# EAGLE design LK-1 Adapter (EAGLE 9.5.2)

## Sheet 1 of 2
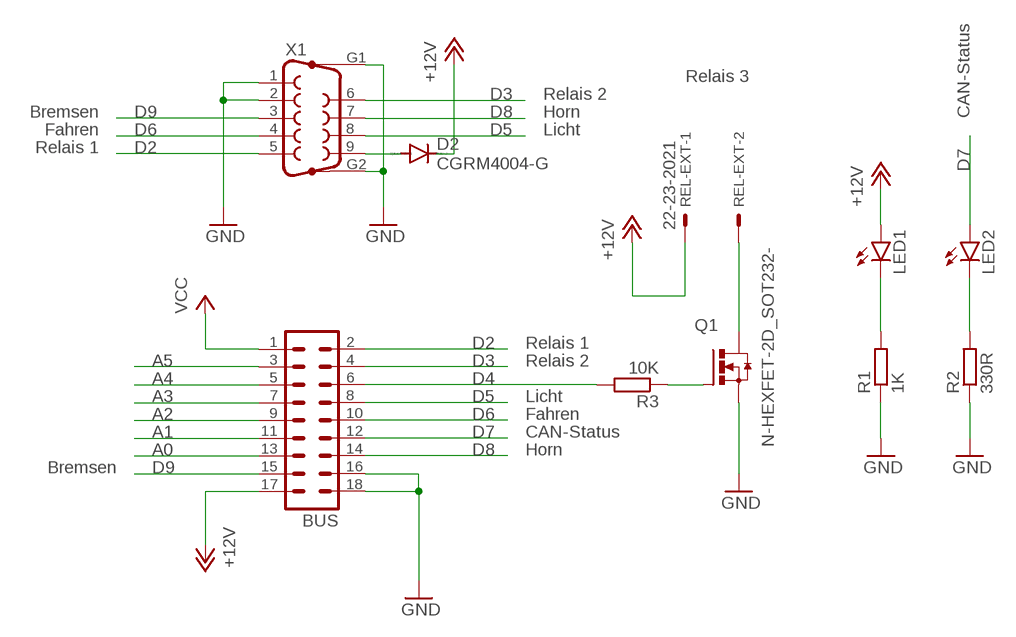
[diagram p0: schematic, sheet 1]

### Parts
BUS  MA09-2  [MA09-2]
D2  CGRM4004-G  [SOD-123_MINI-SMA]
LED1  LED3MM  [LED3MM]
LED2  LED3MM  [LED3MM]
Q1  N-HEXFET-2D_SOT232-  [SOT223]
R1  1K  R-EU_0204/2V  [0204V]
R2  330R  R-EU_0204/2V  [0204V]
R3  10K  R-EU_0204/2V  [0204V]
REL-EXT  22-23-2021  [22-23-2021]
X1  F09VP  [F09VP]

### Nets
+12V: BUS.17 D2.C LED1.A REL-EXT.1
A0: BUS.13
A1: BUS.11
A2: BUS.9
A3: BUS.7
A4: BUS.5
A5: BUS.3
D2: BUS.2 X1.5
D3: BUS.4 X1.6
D4: BUS.6 R3.2
D5: BUS.8 X1.8
D6: BUS.10 X1.4
D7: BUS.12 LED2.A
D8: BUS.14 X1.7
D9: BUS.15 X1.3
GND: BUS.16 BUS.18 Q1.3(S) R1.1 R2.1 X1.1 X1.2 X1.G1 X1.G2
N$1: Q1.1(G) R3.1
N$2: Q1.2(D) Q1.4(D) REL-EXT.2
N$3: D2.A X1.9
N$5: LED1.K(C) R1.2
N$6: LED2.K(C) R2.2
VCC: BUS.1

### Notes on the sheet
- Relais 3
- Relais 2
- Bremsen | Horn | CAN-Status
- Fahren | Licht
- Relais 1
- Relais 1
- Relais 2
- Licht
- Fahren
- CAN-Status
- Horn
- Bremsen

## Sheet 2 of 2

## Library data of the parts
BUS = con-lstb:MA09-2: PIN HEADER; OC_FARNELL: unknown; OC_NEWARK: unknown
D2 = diode:CGRM400*-G: Molded plasitc,JEDEC SOD-123/Mini SMA Source: Comchip CGRM4001-G.pdf
LED1 LED2 = led:LED: LED OSRAM: - CHIPLED LG R971, LG N971, LY N971, LG Q971, LY Q971, LO R971, LY R971 LH N974, LH R974 LS Q976, LO Q976, LY Q976 LO Q996 - Hyper CHIPLED LW Q18S LB Q993, LB Q99A, LB R99A - SideLED LS A670, LO A670, LY A670, LG A670, LP A670 LB A673, LV A673, LT A673, LW A673 LH A674 LY A675 LS A676, LA A676, LO A676, LY A676, LW A676 LS A679, LY A679, LG A679 - Hyper Micro SIDELED® LS Y876, LA Y876, LO Y876, LY Y876 LT Y87S - SmartLED LW L88C, LW L88S LB L89C, LB L89S, LG L890 LS L89K, LO L89K, LY L89K LS L896, LA L896, LO L896, LY L896 - TOPLED LS T670, LO T670, LY T670, LG T670, LP T670 LSG T670, LSP T670, LSY T670, LOP T670, LYG T670 LG T671, LOG T671, LSG T671 LB T673, LV T673, LT T673, LW T673 LH T674 LS T676, LA T676, LO T676, LY T676, LB T676, LH T676, LSB T676, LW T676 LB T67C, LV T67C, LT T67C, LS T67K, LO T67K, LY T67K, LW E67C LS E67B, LA E67B, LO E67B, LY E67B, LB E67C, LV E67C, LT E67C LW T67C LS T679, LY T679, LG T679 LS T770, LO T770, LY T770, LG T770, LP T770 LB T773, LV T773, LT T773, LW T773 LH T774 LS E675, LA E675, LY E675, LS T675 LS T776, LA T776, LO T776, LY T776, LB T776 LHGB T686 LT T68C, LB T68C - Hyper Mini TOPLED® LB M676 - Mini TOPLED Santana® LG M470 LS M47K, LO M47K, LY M47K Source: http://www.osram.convergy.de LUXEON: - LUMILED® LXK2-PW12-R00, LXK2-PW12-S00, LXK2-PW14-U00, LXK2-PW14-V00 LXK2-PM12-R00, LXK2-PM12-S00, LXK2-PM14-U00 LXK2-PE12-Q00, LXK2-PE12-R00, LXK2-PE12-S00, LXK2-PE14-T00, LXK2-PE14-U00 LXK2-PB12-K00, LXK2-PB12-L00, LXK2-PB12-M00, LXK2-PB14-N00, LXK2-PB14-P00, LXK2-PB14-Q00 LXK2-PR12-L00, LXK2-PR12-M00, LXK2-PR14-Q00, LXK2-PR14-R00 LXK2-PD12-Q00, LXK2-PD12-R00, LXK2-PD12-S00 LXK2-PH12-R00, LXK2-PH12-S00 LXK2-PL12-P00, LXK2-PL12-Q00, LXK2-PL12-R00 Source: www.luxeon.com KINGBRIGHT: KA-3528ASYC Source: www.kingbright.com
Q1 = transistor-power:N-HEXFET-2D_?-*: HEXFET® Power MOSFET 2 Drain connects http://www.irf.com/product-info/datasheets/data/irll014n.pdf
R1-R3 = rcl:R-EU_: RESISTOR, European symbol; SPICEPREFIX: R
REL-EXT = con-molex:22-23-2021: .100" (2.54mm) Center Header - 2 Pin; MF: MOLEX; MPN: 22-23-2021; OC_FARNELL: 1462926; OC_NEWARK: 25C3832
X1 = con-subd:F09VP: SUB-D; OC_FARNELL: unknown; OC_NEWARK: unknown

## Board
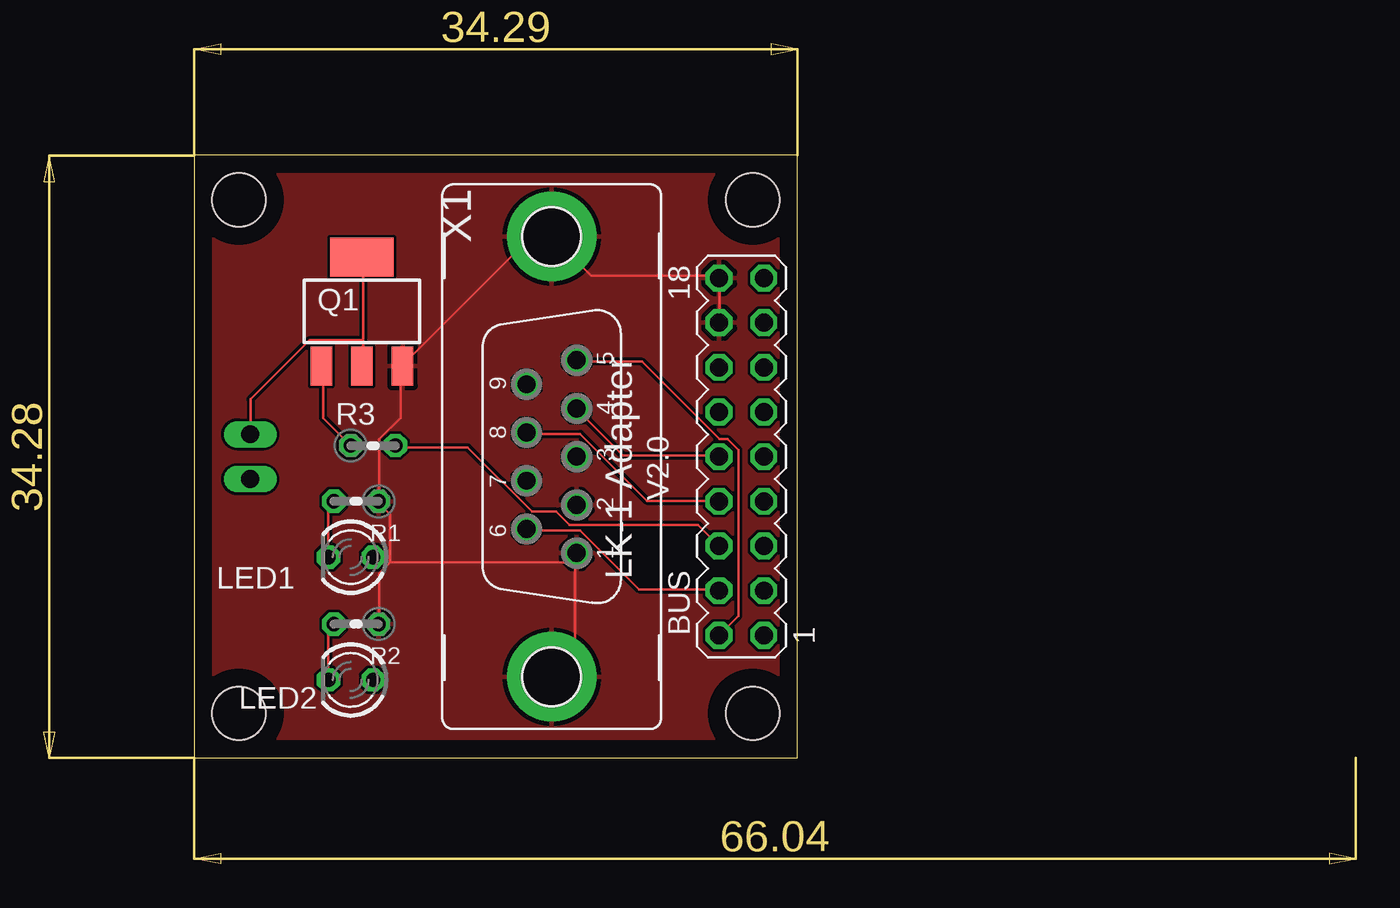
[diagram p1: board, top side]
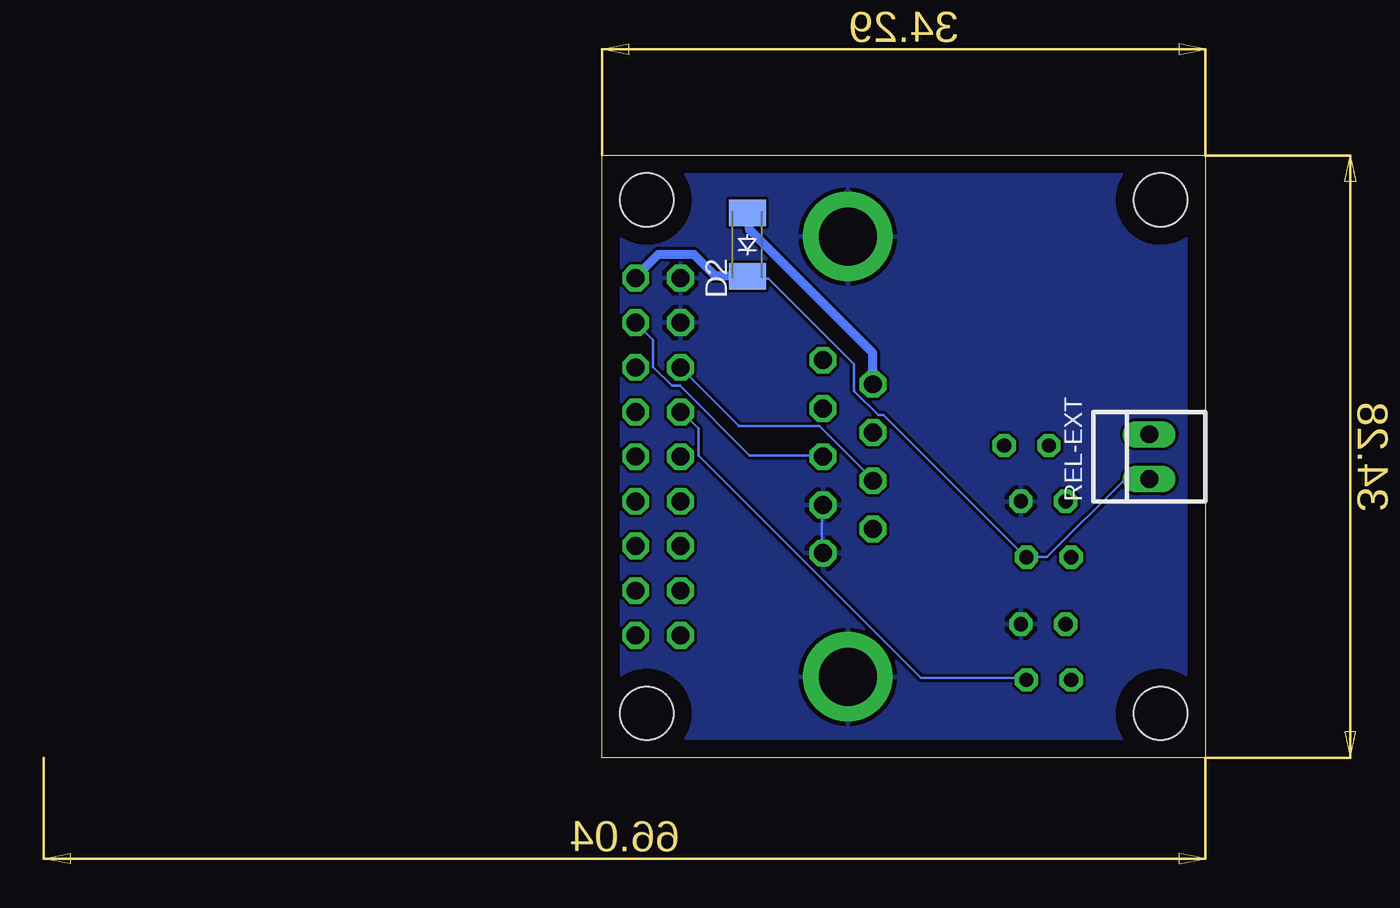
[diagram p2: board, bottom side, seen from below]

Size 34.29 x 34.29 mm. Coordinates in mm from the lower left corner, seen from the top.
Outline: 0,0 34.29,0 34.29,34.29 0,34.29 0,0
Copper layers (1*16): Top 0.035mm / dielectric 1.5mm / Bottom 0.035mm
Design rules "default": minimum track width 6mil, minimum drill 0.35mm, track to track 6mil, track to pad 6mil, pad to pad 6mil, via to via 6mil, smd to smd 6mil, copper to edge 40mil, drill to drill 6mil, minimum pad ring 10mil, minimum via ring 8mil, stop-mask expansion 4mil, vias tented up to drill 0mil, thermal gap 10mil
Holes 3.05 mm at 2.54,2.54 2.54,31.75 31.75,2.54 31.75,31.75

### Footprints (pad centres in the part's own frame; a part is rotated, then mirrored left to right if it is on the bottom)
MA09-2 = drill 1.016 octagon: 1 -10.16,-1.27; 2 -10.16,1.27; 3 -7.62,-1.27; 4 -7.62,1.27; 5 -5.08,-1.27; 6 -5.08,1.27; 7 -2.54,-1.27; 8 -2.54,1.27; 9 0,-1.27; 10 0,1.27; 11 2.54,-1.27; 12 2.54,1.27; 13 5.08,-1.27; 14 5.08,1.27; 15 7.62,-1.27; 16 7.62,1.27; 17 10.16,-1.27; 18 10.16,1.27
SOD-123_MINI-SMA = smd 1.5 x 2.1: A 1.8,0; C -1.8,0
LED3MM = drill 0.813 octagon: A -1.27,0; K 1.27,0
SOT223 = smd 1.219 x 2.235: 1 -2.311,-3.099; 2 0,-3.099; 3 2.311,-3.099 | smd 3.6 x 2.2: 4 0,3.099
0204V = drill 0.813 octagon: 1 -1.27,0; 2 1.27,0
22-23-2021 = drill 1 long: 1 -1.27,0; 2 1.27,0
F09VP = drill 1.016 octagon: 1 5.486,1.422; 2 2.743,1.422; 3 0,1.422; 4 -2.743,1.422; 5 -5.486,1.422; 6 4.115,-1.422; 7 1.372,-1.422; 8 -1.372,-1.422; 9 -4.115,-1.422 | drill 3.302 pad 5.08: G1 -12.522,0; G2 12.522,0

### Placement (x,y rotation side)
BUS  31.11,17.14 90 top
D2  26.04,29.21 90 bottom
LED1  8.89,11.43 180 top
LED2  8.89,4.45 180 top
Q1  9.53,25.4 0 top
R1  9.21,14.61 180 top
R2  9.21,7.62 180 top
R3  10.16,17.78 0 top
REL-EXT  3.17,17.14 90 bottom
X1  20.32,17.14 270 top

### Tracks (layer width: path | path; a pad name or v marks a point on that pad's centre or on a via)
+12V
  Bottom 0.152: 26.06,27.43 D2.C 25.91,27.28 24.84,27.28 19.96,22.4 19.96,20.88 18.59,19.51 18.29,19.51 10.21,11.43 LED1.A 8.99,11.43 4.57,15.85 3.2,15.85 REL-EXT.1
  Bottom 0.508: 26.06,27.43 27.86,27.43 29.1,28.66 31.08,28.66 32.31,27.43 BUS.17
D2
  Top 0.152: BUS.2 30.94,8.08 30.94,17.53 30.33,18.14 29.87,18.14 25.45,22.55 21.79,22.55 X1.5
D3
  Top 0.152: BUS.4 29.72,9.6 25.3,9.6 21.95,12.95 18.9,12.95 X1.6
D4
  Top 0.152: BUS.6 28.65,13.26 21.34,13.26 20.57,14.02 19.2,14.02 15.54,17.68 11.43,17.68 R3.2
D5
  Top 0.152: BUS.8 29.72,14.63 25.76,14.63 21.95,18.44 18.9,18.44 X1.8
D6
  Top 0.152: BUS.10 29.72,17.22 24.38,17.22 21.79,19.81 X1.4
D7
  Bottom 0.152: LED2.A 10.21,4.57 16.15,4.57 28.8,17.22 28.8,18.75 29.72,19.66 BUS.12
D8
  Bottom 0.152: BUS.14 26.52,18.9 21.95,18.9 18.9,15.85 X1.7
D9
  Bottom 0.152: BUS.15 31.39,23.77 31.39,22.25 30.33,21.18 29.87,21.18 25.91,17.22 21.79,17.22 X1.3
GND
  Top 0.152: BUS.16 29.87,24.84 29.87,27.28 BUS.18 29.72,27.43 22.55,27.43 X1.G1 20.27,29.57 19.05,29.57 11.89,22.4 Q1.3 11.73,22.25 11.73,19.36 10.52,18.14 10.52,14.63 R1.1 10.52,14.48 11.12,13.87 11.12,11.12 | 11.12,11.12 10.52,10.52 10.52,7.62 R2.1 | 21.64,11.12 21.64,5.94 X1.G2 | 21.64,11.12 21.64,11.58 X1.1 21.64,11.12 | 21.64,11.12 11.12,11.12
  Bottom 0.152: X1.1 21.79,11.73 21.79,14.33 X1.2
  pour Bottom: 0,34.29 34.29,34.29 34.29,0 0,0
  pour Top: 0,34.29 34.29,34.29 34.29,-0.32 0,-0.32
N$1
  Top 0.152: R3.1 7.32,19.36 7.32,22.25 Q1.1
N$2
  Top 0.152: 9.6,23.77 9.6,28.5 Q1.4 | 9.6,23.77 9.6,22.4 Q1.2 | 9.6,23.77 6.55,23.77 3.2,20.42 3.2,18.44 REL-EXT.2
N$3
  Bottom 0.508: X1.9 18.9,23.04 25.91,30.05 25.91,30.94 D2.A
N$5
  Top 0.152: LED1.K 7.62,14.17 7.92,14.48 R1.2
N$6
  Top 0.152: LED2.K 7.62,7.32 7.92,7.62 R2.2

### Text on the board
tNames: LK-1 Adapter | V2.0